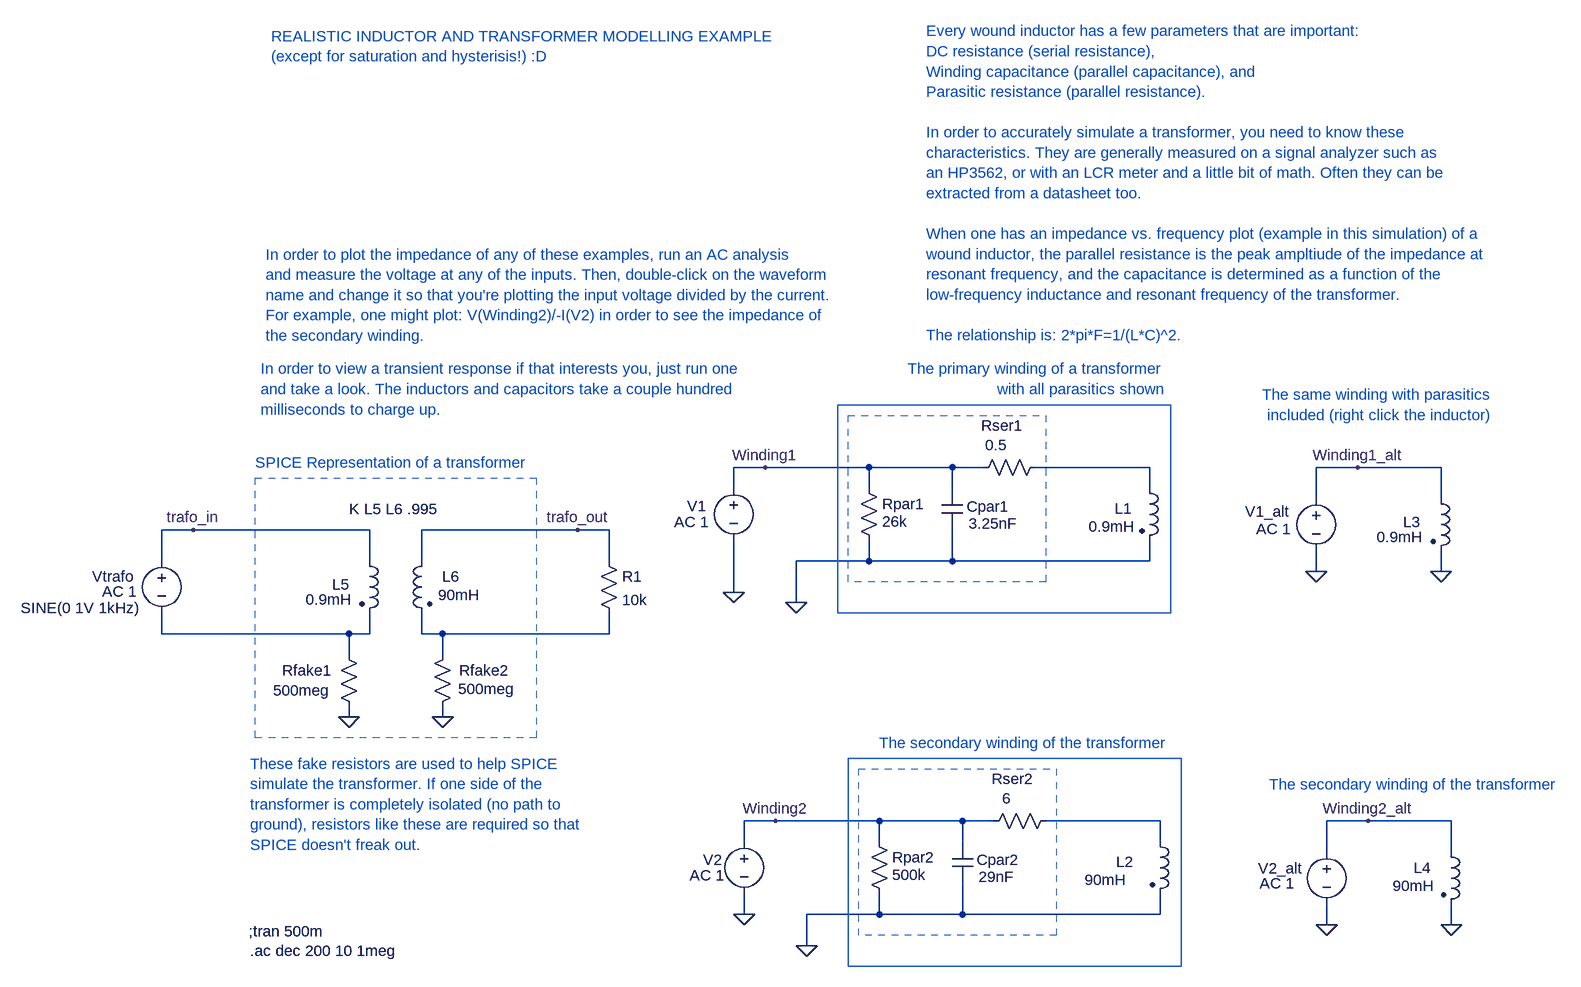
[diagram p0: schematic Transformer modeling example.asc]
Transformer modeling example.asc, the LTspice schematic file:
Version 4
SHEET 1 1508 1236
WIRE -448 368 -496 368
WIRE -288 368 -448 368
WIRE -160 368 -288 368
WIRE -112 368 -160 368
WIRE 144 368 -32 368
WIRE 464 368 400 368
WIRE 592 368 464 368
WIRE -496 400 -496 368
WIRE -288 400 -288 368
WIRE -160 400 -160 368
WIRE 144 400 144 368
WIRE 400 416 400 368
WIRE 592 416 592 368
WIRE -1328 464 -1376 464
WIRE -1056 464 -1328 464
WIRE -736 464 -976 464
WIRE -688 464 -736 464
WIRE -1376 512 -1376 464
WIRE -1056 512 -1056 464
WIRE -976 512 -976 464
WIRE -688 512 -688 464
WIRE -288 512 -288 480
WIRE -288 512 -400 512
WIRE -160 512 -160 464
WIRE -160 512 -288 512
WIRE 144 512 144 480
WIRE 144 512 -160 512
WIRE 400 528 400 496
WIRE 592 528 592 496
WIRE -496 560 -496 480
WIRE -400 576 -400 512
WIRE -1376 624 -1376 592
WIRE -1088 624 -1376 624
WIRE -1056 624 -1056 592
WIRE -1056 624 -1088 624
WIRE -976 624 -976 592
WIRE -944 624 -976 624
WIRE -688 624 -688 592
WIRE -688 624 -944 624
WIRE -1088 656 -1088 624
WIRE -944 656 -944 624
WIRE -1088 752 -1088 736
WIRE -944 752 -944 736
WIRE -432 912 -480 912
WIRE -272 912 -432 912
WIRE -144 912 -272 912
WIRE -96 912 -144 912
WIRE 160 912 -16 912
WIRE 480 912 416 912
WIRE 608 912 480 912
WIRE -480 944 -480 912
WIRE -272 944 -272 912
WIRE -144 944 -144 912
WIRE 160 944 160 912
WIRE 416 960 416 912
WIRE 608 960 608 912
WIRE -480 1056 -480 1024
WIRE -272 1056 -272 1024
WIRE -272 1056 -384 1056
WIRE -144 1056 -144 1008
WIRE -144 1056 -272 1056
WIRE 160 1056 160 1024
WIRE 160 1056 -144 1056
WIRE 416 1072 416 1040
WIRE 608 1072 608 1040
WIRE -384 1104 -384 1056
FLAG -1088 752 0
FLAG -944 752 0
FLAG -496 560 0
FLAG -400 576 0
FLAG 592 528 0
FLAG 608 1072 0
FLAG 416 1072 0
FLAG 400 528 0
FLAG -480 1056 0
FLAG -384 1104 0
FLAG -432 912 Winding2
FLAG -448 368 Winding1
FLAG 464 368 Winding1_alt
FLAG 480 912 Winding2_alt
FLAG -1328 464 trafo_in
FLAG -736 464 trafo_out
SYMBOL ind2 128 384 R0
WINDOW 0 -38 47 Left 0
WINDOW 3 -78 75 Left 0
SYMATTR InstName L1
SYMATTR Value 0.9mH
SYMATTR Type ind
SYMBOL cap -176 400 R0
WINDOW 0 38 28 Left 0
WINDOW 3 41 54 Left 0
SYMATTR InstName Cpar1
SYMATTR Value 3.25nF
SYMBOL res -304 384 R0
WINDOW 3 36 67 Left 0
SYMATTR InstName Rpar1
SYMATTR Value 26k
SYMBOL res -16 352 R90
WINDOW 0 -33 67 VBottom 0
WINDOW 3 -34 76 VTop 0
SYMATTR InstName Rser1
SYMATTR Value 0.5
SYMBOL voltage -496 384 R0
WINDOW 0 -72 43 Left 0
WINDOW 3 43 60 Left 0
WINDOW 123 -92 68 Left 0
WINDOW 39 0 0 Left 0
SYMATTR InstName V1
SYMATTR Value ""
SYMATTR Value2 AC 1
SYMBOL ind2 144 928 R0
WINDOW 0 -52 47 Left 0
WINDOW 3 -100 75 Left 0
SYMATTR InstName L2
SYMATTR Value 90mH
SYMATTR Type ind
SYMBOL cap -160 944 R0
WINDOW 0 38 28 Left 0
WINDOW 3 41 54 Left 0
SYMATTR InstName Cpar2
SYMATTR Value 29nF
SYMBOL res -288 928 R0
WINDOW 3 36 67 Left 0
SYMATTR InstName Rpar2
SYMATTR Value 500k
SYMBOL res 0 896 R90
WINDOW 0 -33 67 VBottom 0
WINDOW 3 -34 76 VTop 0
SYMATTR InstName Rser2
SYMATTR Value 6
SYMBOL voltage -480 928 R0
WINDOW 0 -63 44 Left 0
WINDOW 3 43 60 Left 0
WINDOW 123 -84 68 Left 0
WINDOW 39 0 0 Left 0
SYMATTR InstName V2
SYMATTR Value ""
SYMATTR Value2 AC 1
SYMBOL ind2 576 400 R0
WINDOW 0 -42 52 Left 0
WINDOW 3 -83 75 Left 0
SYMATTR InstName L3
SYMATTR Value 0.9mH
SYMATTR Type ind
SYMATTR SpiceLine Rser=0.5 Rpar=26k Cpar=3.25nF
SYMBOL ind2 592 944 R0
WINDOW 0 -42 40 Left 0
WINDOW 3 -74 68 Left 0
SYMATTR InstName L4
SYMATTR Value 90mH
SYMATTR Type ind
SYMATTR SpiceLine Rser=6 Rpar=500k Cpar=29nF
SYMBOL voltage 400 400 R0
WINDOW 0 -109 36 Left 0
WINDOW 3 -167 60 Left 0
WINDOW 123 -92 63 Left 0
WINDOW 39 0 0 Left 0
SYMATTR InstName V1_alt
SYMATTR Value ""
SYMATTR Value2 AC 1
SYMBOL voltage 416 944 R0
WINDOW 0 -105 41 Left 0
WINDOW 3 -178 47 Left 0
WINDOW 123 -103 64 Left 0
WINDOW 39 0 0 Left 0
SYMATTR InstName V2_alt
SYMATTR Value ""
SYMATTR Value2 AC 1
SYMBOL ind2 -1072 496 R0
WINDOW 0 -42 52 Left 0
WINDOW 3 -83 75 Left 0
SYMATTR InstName L5
SYMATTR Value 0.9mH
SYMATTR Type ind
SYMATTR SpiceLine Rser=0.5 Rpar=26k Cpar=3.25nF
SYMBOL res -1104 640 R0
WINDOW 0 -87 40 Left 0
WINDOW 3 -101 71 Left 0
SYMATTR InstName Rfake1
SYMATTR Value 500meg
SYMBOL ind2 -960 496 M0
WINDOW 0 -42 40 Left 0
WINDOW 3 -74 68 Left 0
SYMATTR InstName L6
SYMATTR Value 90mH
SYMATTR Type ind
SYMATTR SpiceLine Rser=6 Rpar=500k Cpar=29nF
SYMBOL res -928 640 M0
WINDOW 0 -86 40 Left 0
WINDOW 3 -96 69 Left 0
SYMATTR InstName Rfake2
SYMATTR Value 500meg
SYMBOL voltage -1376 496 R0
WINDOW 0 -107 40 Left 0
WINDOW 3 -217 88 Left 0
WINDOW 123 -92 63 Left 0
WINDOW 39 0 0 Left 0
SYMATTR InstName Vtrafo
SYMATTR Value SINE(0 1V 1kHz)
SYMATTR Value2 AC 1
SYMBOL res -704 496 R0
SYMATTR InstName R1
SYMATTR Value 10k
TEXT -1242 1082 Left 0 !;tran 500m
TEXT -1240 1112 Left 0 !.ac dec 200 10 1meg
TEXT -1088 432 Left 0 !K L5 L6 .995
TEXT -1232 360 Left 0 ;SPICE Representation of a transformer
TEXT 168 216 Right 0 ;The primary winding of a transformer\nwith all parasitics shown
TEXT 672 256 Right 0 ;The same winding with parasitics\nincluded (right click the inductor)
TEXT -272 792 Left 0 ;The secondary winding of the transformer
TEXT 328 856 Left 0 ;The secondary winding of the transformer
TEXT -1240 824 Left 0 ;These fake resistors are used to help SPICE\nsimulate the transformer. If one side of the\ntransformer is completely isolated (no path to\nground), resistors like these are required so that\nSPICE doesn't freak out.
TEXT -1216 40 Left 0 ;In order to plot the impedance of any of these examples, run an AC analysis\nand measure the voltage at any of the inputs. Then, double-click on the waveform\nname and change it so that you're plotting the input voltage divided by the current.\nFor example, one might plot: V(Winding2)/-I(V2) in order to see the impedance of\nthe secondary winding.
TEXT -1224 216 Left 0 ;In order to view a transient response if that interests you, just run one\nand take a look. The inductors and capacitors take a couple hundred\nmilliseconds to charge up.
TEXT -1208 -296 Left 0 ;REALISTIC INDUCTOR AND TRANSFORMER MODELLING EXAMPLE\n(except for saturation and hysterisis!) :D
TEXT -200 -304 Left 0 ;Every wound inductor has a few parameters that are important:\nDC resistance (serial resistance),\nWinding capacitance (parallel capacitance), and\nParasitic resistance (parallel resistance). \n \nIn order to accurately simulate a transformer, you need to know these\ncharacteristics. They are generally measured on a signal analyzer such as\nan HP3562, or with an LCR meter and a little bit of math. Often they can be\nextracted from a datasheet too.\n \nWhen one has an impedance vs. frequency plot (example in this simulation) of a\nwound inductor, the parallel resistance is the peak ampltiude of the impedance at\nresonant frequency, and the capacitance is determined as a function of the\nlow-frequency inductance and resonant frequency of the transformer.\n \nThe relationship is: 2*pi*F=1/(L*C)^2.
RECTANGLE Normal -16 544 -320 288 1
RECTANGLE Normal 176 592 -336 272
RECTANGLE Normal 0 1088 -304 832 1
RECTANGLE Normal 192 1136 -320 816
RECTANGLE Normal -800 784 -1232 384 1

The netlist it stands for:
* Transformer modeling example.asc
L1 N001 0 0.9mH
Cpar1 Winding1 0 3.25nF
Rpar1 Winding1 0 26k
Rser1 N001 Winding1 0.5
V1 Winding1 0 AC 1
L2 N004 0 90mH
Cpar2 Winding2 0 29nF
Rpar2 Winding2 0 500k
Rser2 N004 Winding2 6
V2 Winding2 0 AC 1
L3 Winding1_alt 0 0.9mH Rser=0.5 Rpar=26k Cpar=3.25nF
L4 Winding2_alt 0 90mH Rser=6 Rpar=500k Cpar=29nF
V1_alt Winding1_alt 0 AC 1
V2_alt Winding2_alt 0 AC 1
L5 trafo_in N002 0.9mH Rser=0.5 Rpar=26k Cpar=3.25nF
Rfake1 N002 0 500meg
L6 trafo_out N003 90mH Rser=6 Rpar=500k Cpar=29nF
Rfake2 N003 0 500meg
Vtrafo trafo_in N002 SINE(0 1V 1kHz) AC 1
R1 trafo_out N003 10k
;tran 500m
.ac dec 200 10 1meg
K L5 L6 .995
* SPICE Representation of a transformer
* The primary winding of a transformer
* with all parasitics shown
* The same winding with parasitics
* included (right click the inductor)
* The secondary winding of the transformer
* The secondary winding of the transformer
* These fake resistors are used to help SPICE
* simulate the transformer. If one side of the
* transformer is completely isolated (no path to
* ground), resistors like these are required so that
* SPICE doesn't freak out.
* In order to plot the impedance of any of these examples, run an AC analysis
* and measure the voltage at any of the inputs. Then, double-click on the waveform
* name and change it so that you're plotting the input voltage divided by the current.
* For example, one might plot: V(Winding2)/-I(V2) in order to see the impedance of
* the secondary winding.
* In order to view a transient response if that interests you, just run one
* and take a look. The inductors and capacitors take a couple hundred
* milliseconds to charge up.
* REALISTIC INDUCTOR AND TRANSFORMER MODELLING EXAMPLE
* (except for saturation and hysterisis!) :D
* Every wound inductor has a few parameters that are important:
* DC resistance (serial resistance),
* Winding capacitance (parallel capacitance), and
* Parasitic resistance (parallel resistance).
* In order to accurately simulate a transformer, you need to know these
* characteristics. They are generally measured on a signal analyzer such as
* an HP3562, or with an LCR meter and a little bit of math. Often they can be
* extracted from a datasheet too.
* When one has an impedance vs. frequency plot (example in this simulation) of a
* wound inductor, the parallel resistance is the peak ampltiude of the impedance at
* resonant frequency, and the capacitance is determined as a function of the
* low-frequency inductance and resonant frequency of the transformer.
* The relationship is: 2*pi*F=1/(L*C)^2.
.backanno
.end